# Altium schematic sheet Power Pins Page RV1126.SchDoc: Power Of CPU
size A4 portrait; DrawnBy: ThanhQuoc; Revision: V01; SheetNumber: 5; SheetTotal: 21; Project: RV1126 CAMERA BOARD DESIGN
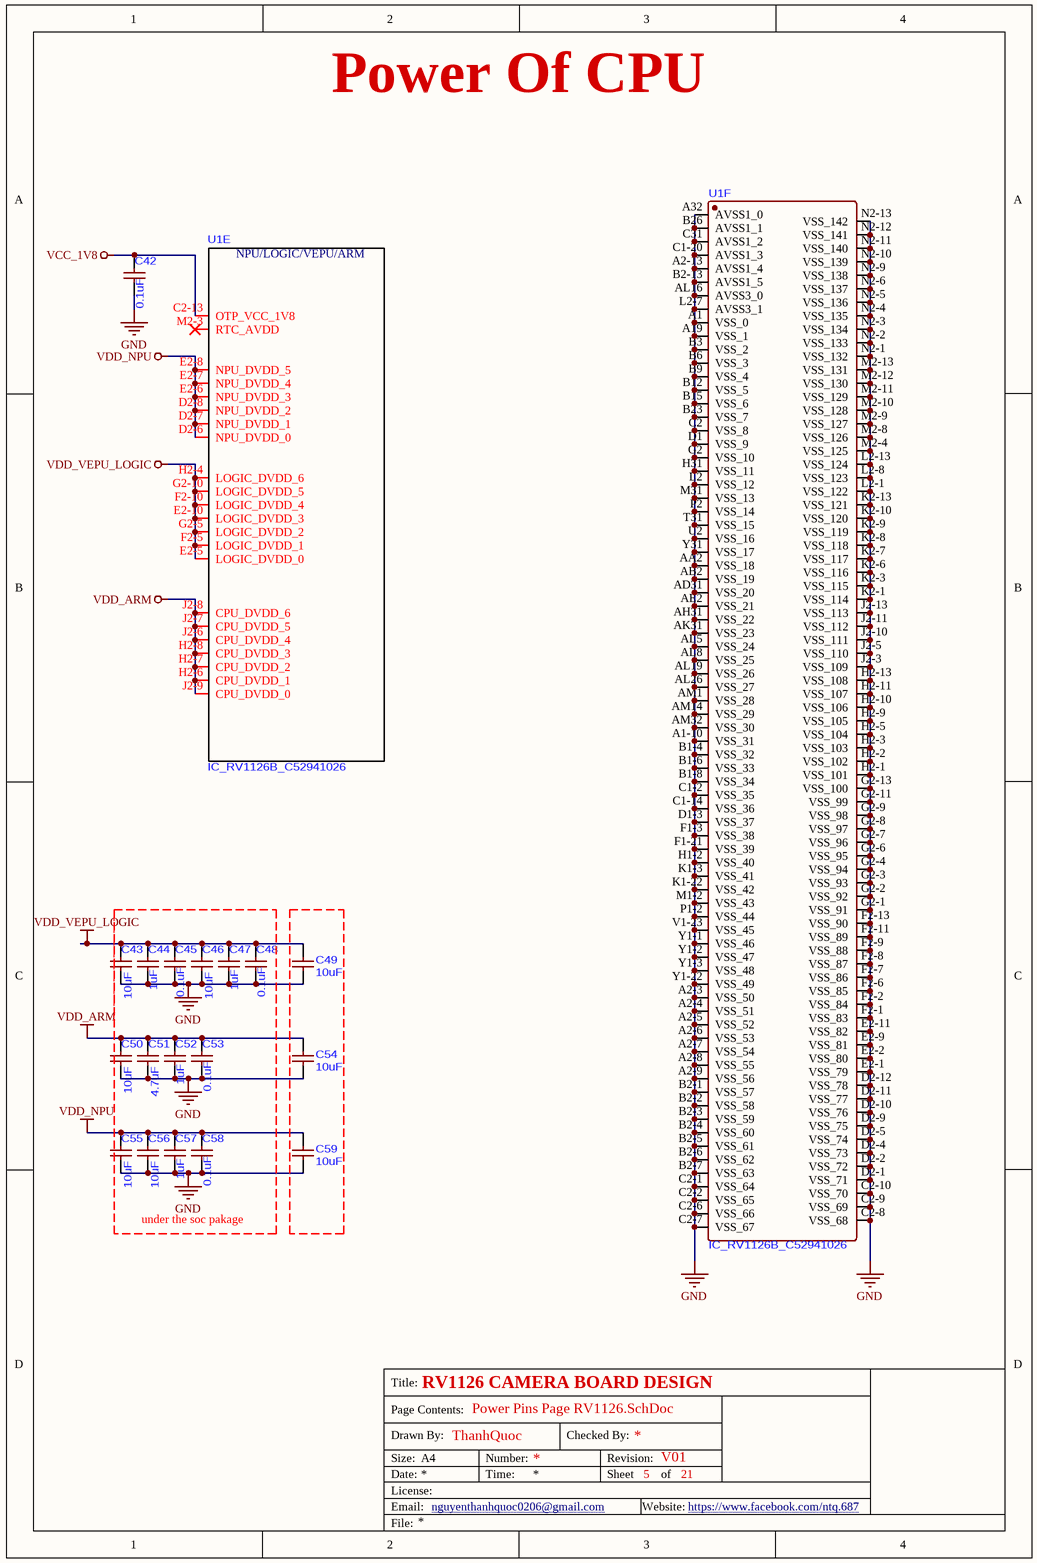
[diagram p0: Power Pins Page RV1126.SchDoc]

## Parts
C42  0.1uF  [C0201]
C43  10uF  [C0402]
C44  1uF  [C0201]
C45  0.1uF  [C0201]
C46  10uF  [C0402]
C47  1uF  [C0201]
C48  0.1uF  [C0201]
C49  10uF  [C0402]
C50  10uF  [C0402]
C51  4.7uF  [C0402]
C52  1uF  [C0201]
C53  0.1uF  [C0201]
C54  10uF  [C0402]
C55  10uF  [C0402]
C56  10uF  [C0402]
C57  1uF  [C0201]
C58  0.1uF  [C0201]
C59  10uF  [C0402]
U1  IC_RV1126B_C52941026  [CCSP-491_L14.0-W14.0-TL_RV1126B]  (parts E,F of 18)

## Nets
GND: C42.1 C43.1 C44.1 C45.1 C46.1 C47.1 C48.1 C49.1 C50.1 C51.1 C52.1 C53.1 C54.1 C55.1 C56.1 C57.1 C58.1 C59.1 U1.A1(VSS_0) U1.A1-10(VSS_31) U1.A2-3(VSS_50) U1.A2-4(VSS_51) U1.A2-5(VSS_52) U1.A2-6(VSS_53) U1.A2-7(VSS_54) U1.A2-8(VSS_55) U1.A2-9(VSS_56) U1.A2-13(AVSS1_4) U1.A19(VSS_1) U1.A32(AVSS1_0) U1.AA2(VSS_18) U1.AB2(VSS_19) U1.AD31(VSS_20) U1.AE2(VSS_21) U1.AH31(VSS_22) U1.AK31(VSS_23) U1.AL5(VSS_24) U1.AL8(VSS_25) U1.AL16(AVSS3_0) U1.AL19(VSS_26) U1.AL26(VSS_27) U1.AM1(VSS_28) U1.AM14(VSS_29) U1.AM32(VSS_30) U1.B1-4(VSS_32) U1.B1-6(VSS_33) U1.B1-8(VSS_34) U1.B2-1(VSS_57) U1.B2-2(VSS_58) U1.B2-3(VSS_59) U1.B2-4(VSS_60) U1.B2-5(VSS_61) U1.B2-6(VSS_62) U1.B2-7(VSS_63) U1.B2-13(AVSS1_5) U1.B3(VSS_2) U1.B6(VSS_3) U1.B9(VSS_4) U1.B12(VSS_5) U1.B15(VSS_6) U1.B23(VSS_7) U1.B26(AVSS1_1) U1.C1-2(VSS_35) U1.C1-14(VSS_36) U1.C1-20(AVSS1_3) U1.C2(VSS_8) U1.C2-1(VSS_64) U1.C2-2(VSS_65) U1.C2-6(VSS_66) U1.C2-7(VSS_67) U1.C2-8(VSS_68) U1.C2-9(VSS_69) U1.C2-10(VSS_70) U1.C31(AVSS1_2) U1.D1(VSS_9) U1.D1-3(VSS_37) U1.D2-1(VSS_71) U1.D2-2(VSS_72) U1.D2-4(VSS_73) U1.D2-5(VSS_74) U1.D2-9(VSS_75) U1.D2-10(VSS_76) U1.D2-11(VSS_77) U1.D2-12(VSS_78) U1.E2-1(VSS_79) U1.E2-2(VSS_80) U1.E2-9(VSS_81) U1.E2-11(VSS_82) U1.F1-3(VSS_38) U1.F1-21(VSS_39) U1.F2-1(VSS_83) U1.F2-2(VSS_84) U1.F2-6(VSS_85) U1.F2-7(VSS_86) U1.F2-8(VSS_87) U1.F2-9(VSS_88) U1.F2-11(VSS_89) U1.F2-13(VSS_90) U1.G2(VSS_10) U1.G2-1(VSS_91) U1.G2-2(VSS_92) U1.G2-3(VSS_93) U1.G2-4(VSS_94) U1.G2-6(VSS_95) U1.G2-7(VSS_96) U1.G2-8(VSS_97) U1.G2-9(VSS_98) U1.G2-11(VSS_99) U1.G2-13(VSS_100) U1.H1-2(VSS_40) U1.H2-1(VSS_101) U1.H2-2(VSS_102) U1.H2-3(VSS_103) U1.H2-5(VSS_104) U1.H2-9(VSS_105) U1.H2-10(VSS_106) U1.H2-11(VSS_107) U1.H2-13(VSS_108) U1.H31(VSS_11) U1.J2-3(VSS_109) U1.J2-5(VSS_110) U1.J2-10(VSS_111) U1.J2-11(VSS_112) U1.J2-13(VSS_113) U1.K1-3(VSS_41) U1.K1-22(VSS_42) U1.K2-1(VSS_114) U1.K2-3(VSS_115) U1.K2-6(VSS_116) U1.K2-7(VSS_117) U1.K2-8(VSS_118) U1.K2-9(VSS_119) U1.K2-10(VSS_120) U1.K2-13(VSS_121) U1.L2(VSS_12) U1.L2-1(VSS_122) U1.L2-7(AVSS3_1) U1.L2-8(VSS_123) U1.L2-13(VSS_124) U1.M1-2(VSS_43) U1.M2-4(VSS_125) U1.M2-8(VSS_126) U1.M2-9(VSS_127) U1.M2-10(VSS_128) U1.M2-11(VSS_129) U1.M2-12(VSS_130) U1.M2-13(VSS_131) U1.M31(VSS_13) U1.N2-1(VSS_132) U1.N2-2(VSS_133) U1.N2-3(VSS_134) U1.N2-4(VSS_135) U1.N2-5(VSS_136) U1.N2-6(VSS_137) U1.N2-9(VSS_138) U1.N2-10(VSS_139) U1.N2-11(VSS_140) U1.N2-12(VSS_141) U1.N2-13(VSS_142) U1.P1-2(VSS_44) U1.P2(VSS_14) U1.T31(VSS_15) U1.U2(VSS_16) U1.V1-23(VSS_45) U1.Y1-1(VSS_46) U1.Y1-2(VSS_47) U1.Y1-3(VSS_48) U1.Y1-22(VSS_49) U1.Y31(VSS_17)
VCC_1V8: C42.2 U1.C2-13(OTP_VCC_1V8)
VDD_ARM: C50.2 C51.2 C52.2 C53.2 C54.2 U1.H2-6(CPU_DVDD_1) U1.H2-7(CPU_DVDD_2) U1.H2-8(CPU_DVDD_3) U1.J2-6(CPU_DVDD_4) U1.J2-7(CPU_DVDD_5) U1.J2-8(CPU_DVDD_6) U1.J2-9(CPU_DVDD_0)
VDD_NPU: C55.2 C56.2 C57.2 C58.2 C59.2 U1.D2-6(NPU_DVDD_0) U1.D2-7(NPU_DVDD_1) U1.D2-8(NPU_DVDD_2) U1.E2-6(NPU_DVDD_3) U1.E2-7(NPU_DVDD_4) U1.E2-8(NPU_DVDD_5)
VDD_VEPU_LOGIC: C43.2 C44.2 C45.2 C46.2 C47.2 C48.2 C49.2 U1.E2-5(LOGIC_DVDD_0) U1.E2-10(LOGIC_DVDD_3) U1.F2-5(LOGIC_DVDD_1) U1.F2-10(LOGIC_DVDD_4) U1.G2-5(LOGIC_DVDD_2) U1.G2-10(LOGIC_DVDD_5) U1.H2-4(LOGIC_DVDD_6)

Not connected (* = marked no-connect by the designer): U1 M2-3(RTC_AVDD)*

## Notes on the sheet
- under the soc pakage
- Title:
- Drawn By:
- Page Contents:
- Checked By:
- Size:
- Date:
- File:
- License:
- Email:
- A4
- nguyenthanhquoc0206@gmail.com
- Number:
- Time:
- Revision:
- Sheet
- Website:
- of
- https://www.facebook.com/ntq.687
- (in symbol IC_RV1126B_C52941026, part E) NPU/LOGIC/VEPU/ARM

## Library data of the parts
C42 C45 C48 C53 C58 = CAP_100nF-6.3V-10%-0201_1: 0.1uF ±10% 6.3V Ceramic Capacitor X5R 0201
C43 C46 C49 C50 C54-C56 C59 = CAP_10uF-10V-20%-0402: 10µF ±20% 10V Ceramic Capacitor X5R 0402 (1005 Metric)
C44 C47 C52 C57 = CAP_1uF-6.3V-10%-0201: 1uF ±10% 6.3V Ceramic Capacitor X5R 0201
C51 = CAP_4.7uF-10V-10%-0402: 4.7µF ±10% 10V Ceramic Capacitor X5R 0402 (1005 Metric)